# EAGLE design Test10122022 (EAGLE 9.6.2)
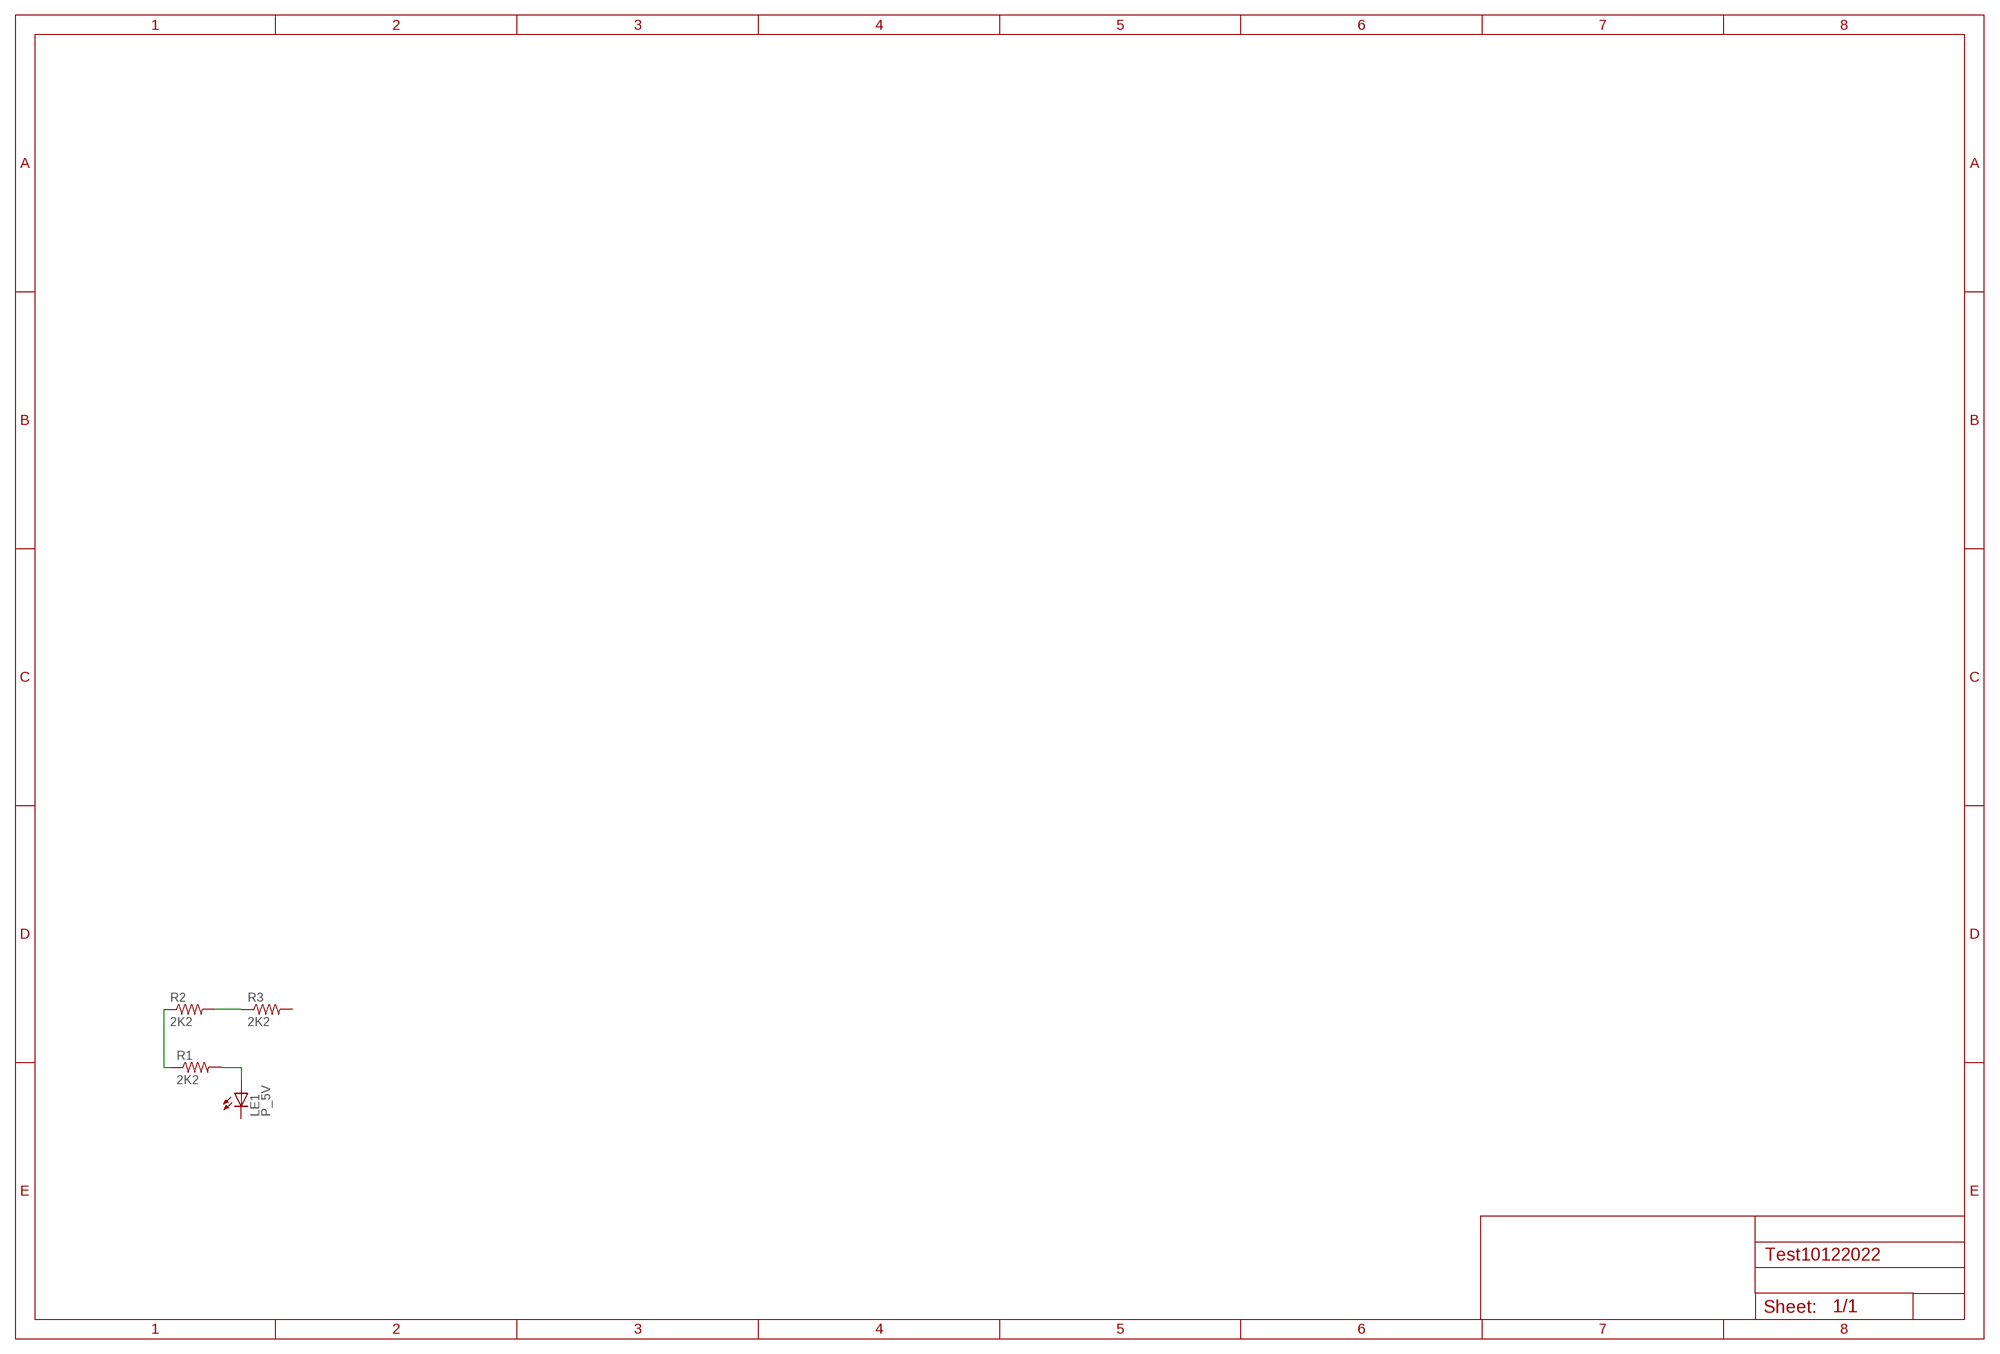
[diagram p0: schematic, sheet 1]

## Parts
LE1  P_5V  LED0603  [0603P]
R1  2K2  R0603  [R0603]
R2  2K2  R0603  [R0603]
R3  2K2  R0603  [R0603]

## Nets
N$1: LE1.2(A) R1.2
N$6: R1.1 R2.1
N$7: R2.2 R3.1
Unconnected: LE1.1(C) R3.2

## Library data of the parts
LE1 = Dkoi:LED0603
R1-R3 = An:R0603

## Board
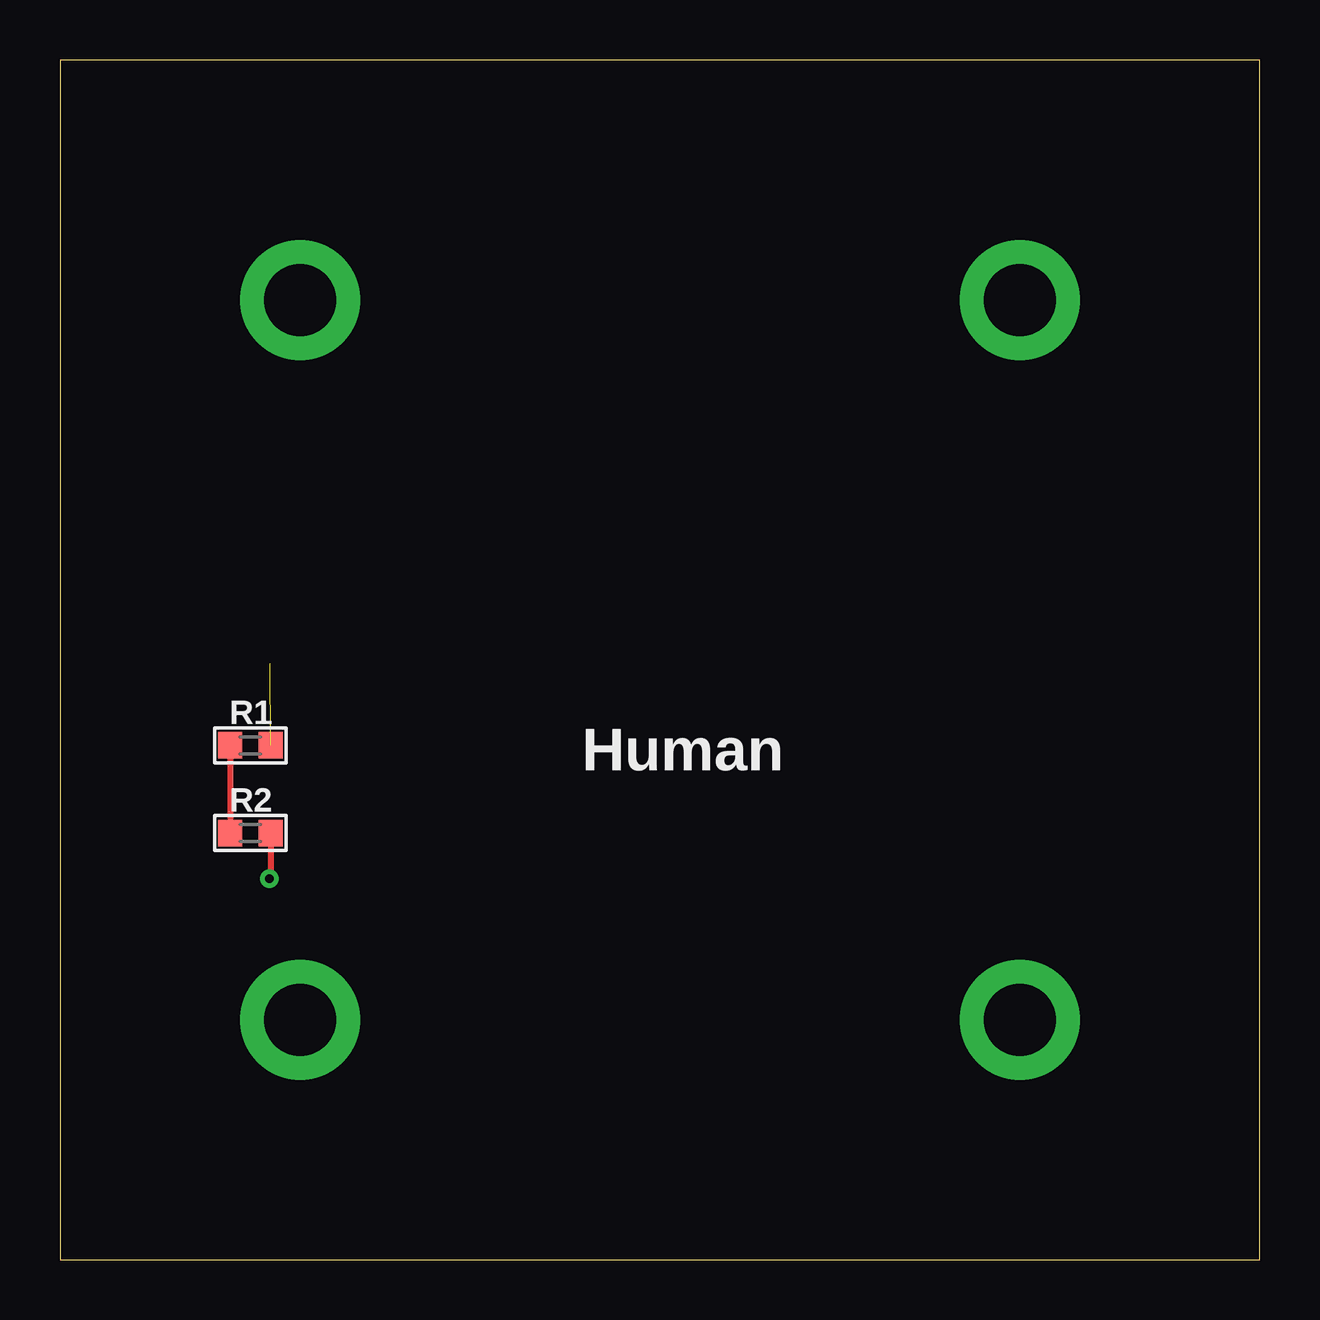
[diagram p1: board, top side]
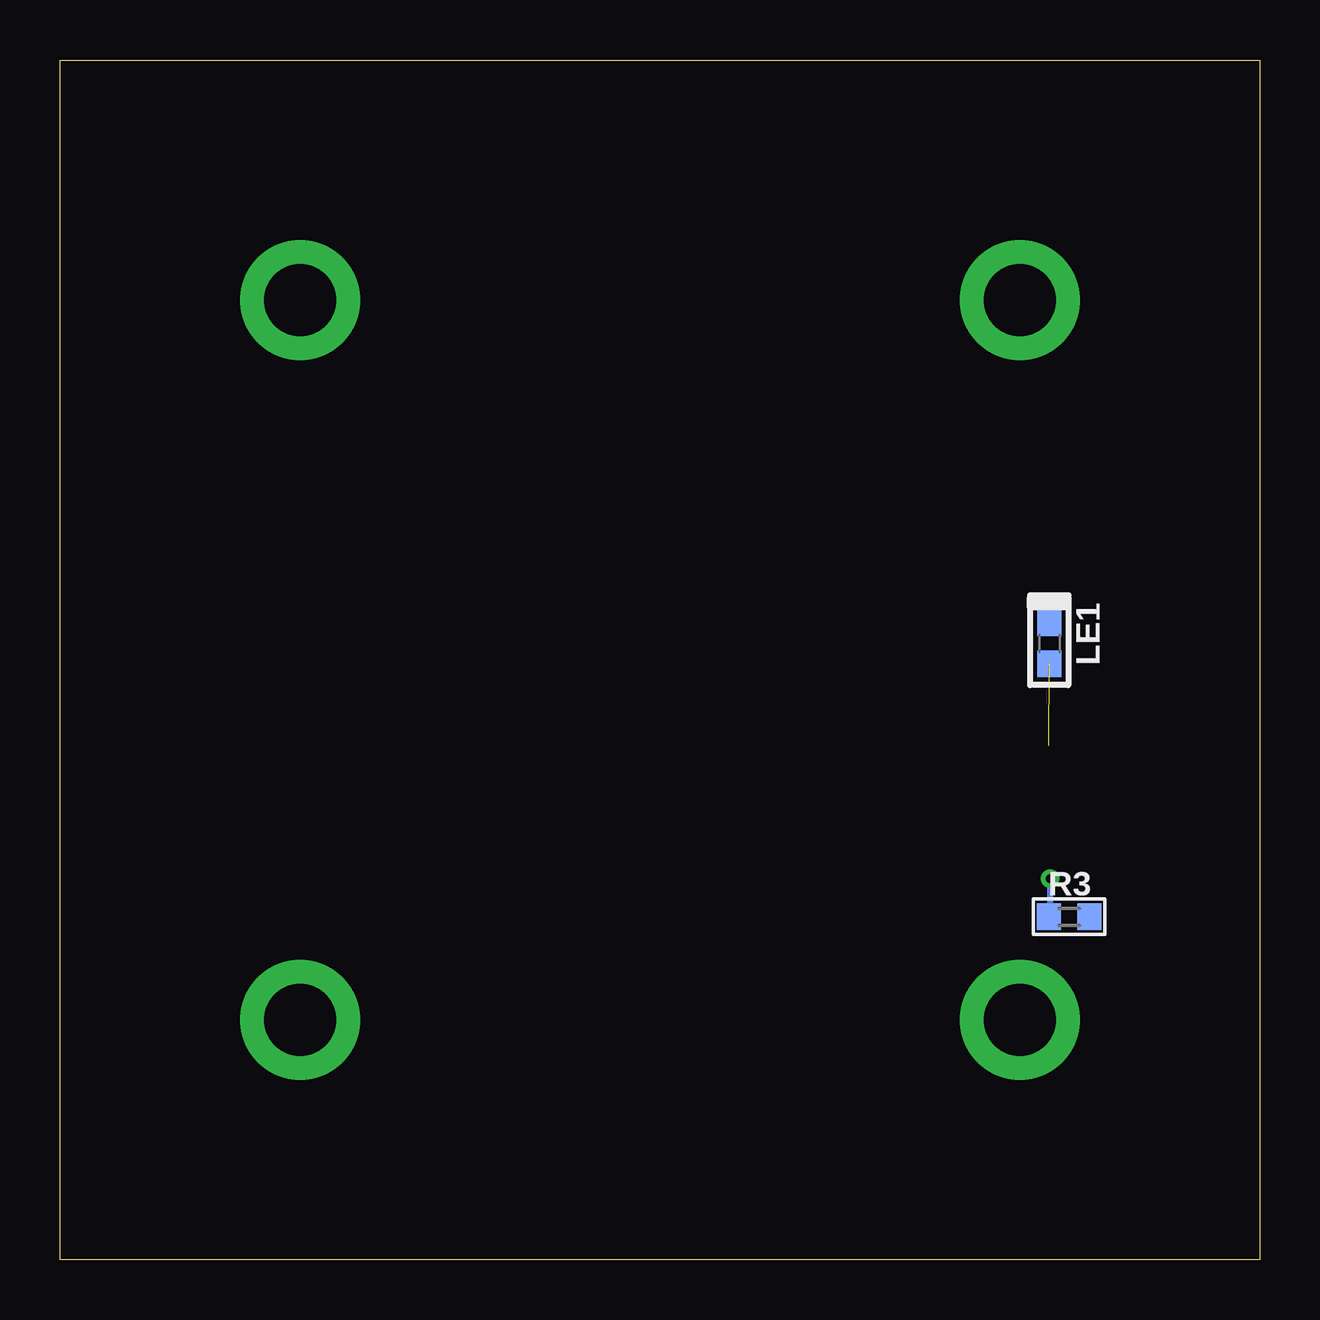
[diagram p2: board, bottom side, seen from below]

Size 50 x 50 mm. Coordinates in mm from the lower left corner, seen from the top.
Outline: 0,0 50,0 50,50 0,50 0,0
Copper layers (1*16): Top 0.035mm / dielectric 1.5mm / Bottom 0.035mm
Design rules "default": minimum track width 6mil, minimum drill 0.35mm, track to track 6mil, track to pad 6mil, pad to pad 6mil, via to via 6mil, smd to smd 6mil, copper to edge 40mil, drill to drill 6mil, minimum pad ring 10mil, minimum via ring 8mil, stop-mask expansion 4mil, vias tented up to drill 0mil, thermal gap 10mil

### Footprints (pad centres in the part's own frame; a part is rotated, then mirrored left to right if it is on the bottom)
0603P = smd 1.1 x 1: 1 -0.85,0; 2 0.85,0
R0603 = smd 1 x 1.1: 1 -0.85,0; 2 0.85,0

### Placement (x,y rotation side)
LE1  8.76,25.68 270 bottom
R1  7.94,21.43 0 top
R2  7.94,17.78 0 top
R3  7.94,14.29 0 bottom

### Tracks (layer width: path | path; a pad name or v marks a point on that pad's centre or on a via)
N$1  (1 unrouted)
  Top 0.25: R1.2 8.89,21.33
N$2  (via drill 3 pad 5)
  other vias: 10,40
N$3  (via drill 3 pad 5)
  other vias: 40,40
N$4  (via drill 3 pad 5)
  other vias: 40,10
N$5  (via drill 3 pad 5)
  other vias: 10,10
N$6
  Top 0.25: R1.1 R2.1
N$7  (via drill 0.35)
  Top 0.25: R2.2 8.79,16.09 8.73,16.03 v8.73,15.87
  Bottom 0.25: v8.73,15.87 8.73,14.34 R3.1

### Text on the board
tNames: Human